# Altium schematic sheet Analog.SchDoc
size A
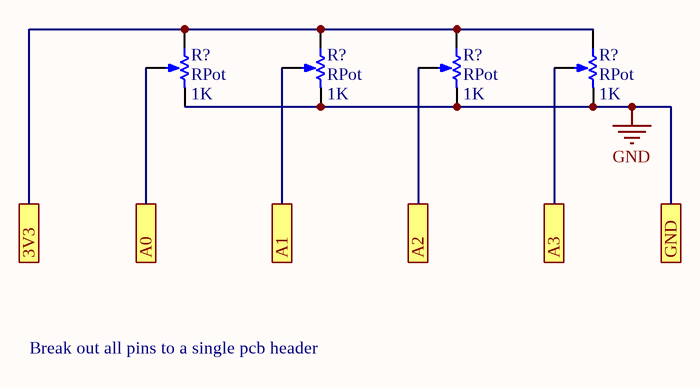
[diagram p0: Analog.SchDoc]

## Parts
(Parts that share a designator on the sheet are numbered #1, #2 ... from top to bottom, then left to right.)
R?#1  RPot  value 1K  [VR5]
R?#2  RPot  value 1K  [VR5]
R?#3  RPot  value 1K  [VR5]
R?#4  RPot  value 1K  [VR5]

## Ports
3V3, A0, A1, A2, A3, GND

## Nets
GND: R?#1.2(BOT) R?#2.2(BOT) R?#3.2(BOT) R?#4.2(BOT) ; port GND
3V3: R?#1.1(TOP) R?#2.1(TOP) R?#3.1(TOP) R?#4.1(TOP) ; port 3V3
A0: R?#1.3(TAP) ; port A0
A1: R?#2.3(TAP) ; port A1
A2: R?#3.3(TAP) ; port A2
A3: R?#4.3(TAP) ; port A3

## Notes on the sheet
- Break out all pins to a single pcb header

## Library data of the parts
R?#1-R?#4 = RPot: Potentiometer; Sim Note: Enter the Resistance value and the set point into parameter fields.; Set Position: 0.5; Published: 8-Jun-2000; LatestRevisionDate: 17-Jul-2002; LatestRevisionNote: Re-released for DXP Platform.; PackageReference: VR5; Publisher: Altium Limited; PackageDescription: Variable Resistor, Thru-Hole; 3 Leads